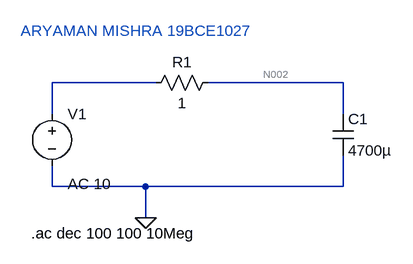
[diagram p0: schematic lab_1_task_3.asc]
lab_1_task_3.asc, the LTspice schematic file:
Version 4
SHEET 1 880 680
WIRE 144 64 -16 64
WIRE 432 64 224 64
WIRE -16 112 -16 64
WIRE 432 112 432 64
WIRE -16 224 -16 192
WIRE 128 224 -16 224
WIRE 432 224 432 176
WIRE 432 224 128 224
WIRE 128 272 128 224
FLAG 128 272 0
SYMBOL voltage -16 96 R0
WINDOW 123 24 124 Left 2
WINDOW 39 0 0 Left 0
SYMATTR Value2 AC 10
SYMATTR InstName V1
SYMATTR Value ""
SYMBOL res 240 48 R90
WINDOW 0 0 56 VBottom 2
WINDOW 3 32 56 VTop 2
SYMATTR InstName R1
SYMATTR Value 1
SYMBOL cap 416 112 R0
SYMATTR InstName C1
SYMATTR Value 4700µ
TEXT -48 296 Left 2 !.ac dec 100 100 10Meg
TEXT -64 -16 Left 2 ;ARYAMAN MISHRA 19BCE1027

The netlist it stands for:
* lab_1_task_3.asc
V1 N001 0 AC 10
R1 N002 N001 1
C1 N002 0 4700µ
.ac dec 100 100 10Meg
* ARYAMAN MISHRA 19BCE1027
.backanno
.end

* Results of the author's LTspice run, read from the files saved beside the schematic
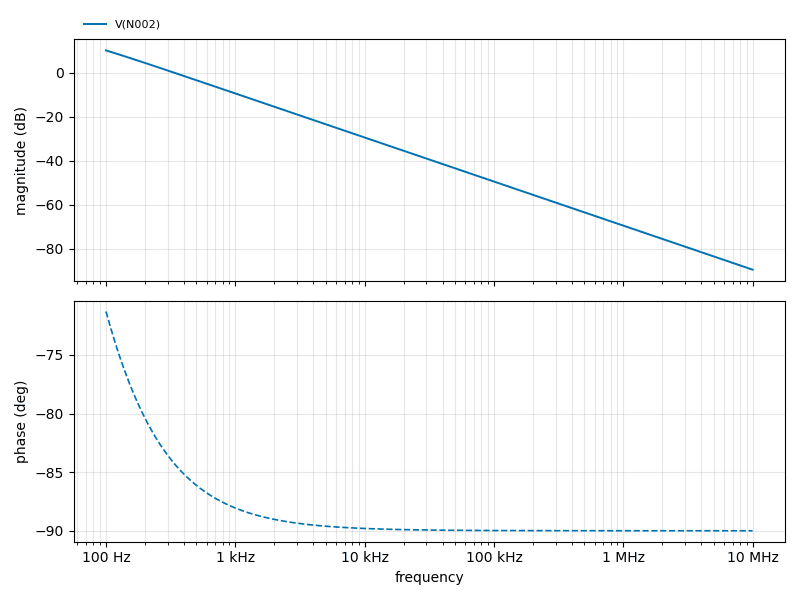
[diagram p1: AC Analysis of lab_1_task_3.asc, plotted from the saved traces]
* AC Analysis, 1 run:
*   V(N002): 10.12 dB at 100 Hz, -89.41 dB at 10 MHz, peak 10.12 dB at 100 Hz, 3 dB below the peak at 145.4 Hz